# EAGLE design avr-hvsp-programmer (EAGLE 7.7.0)
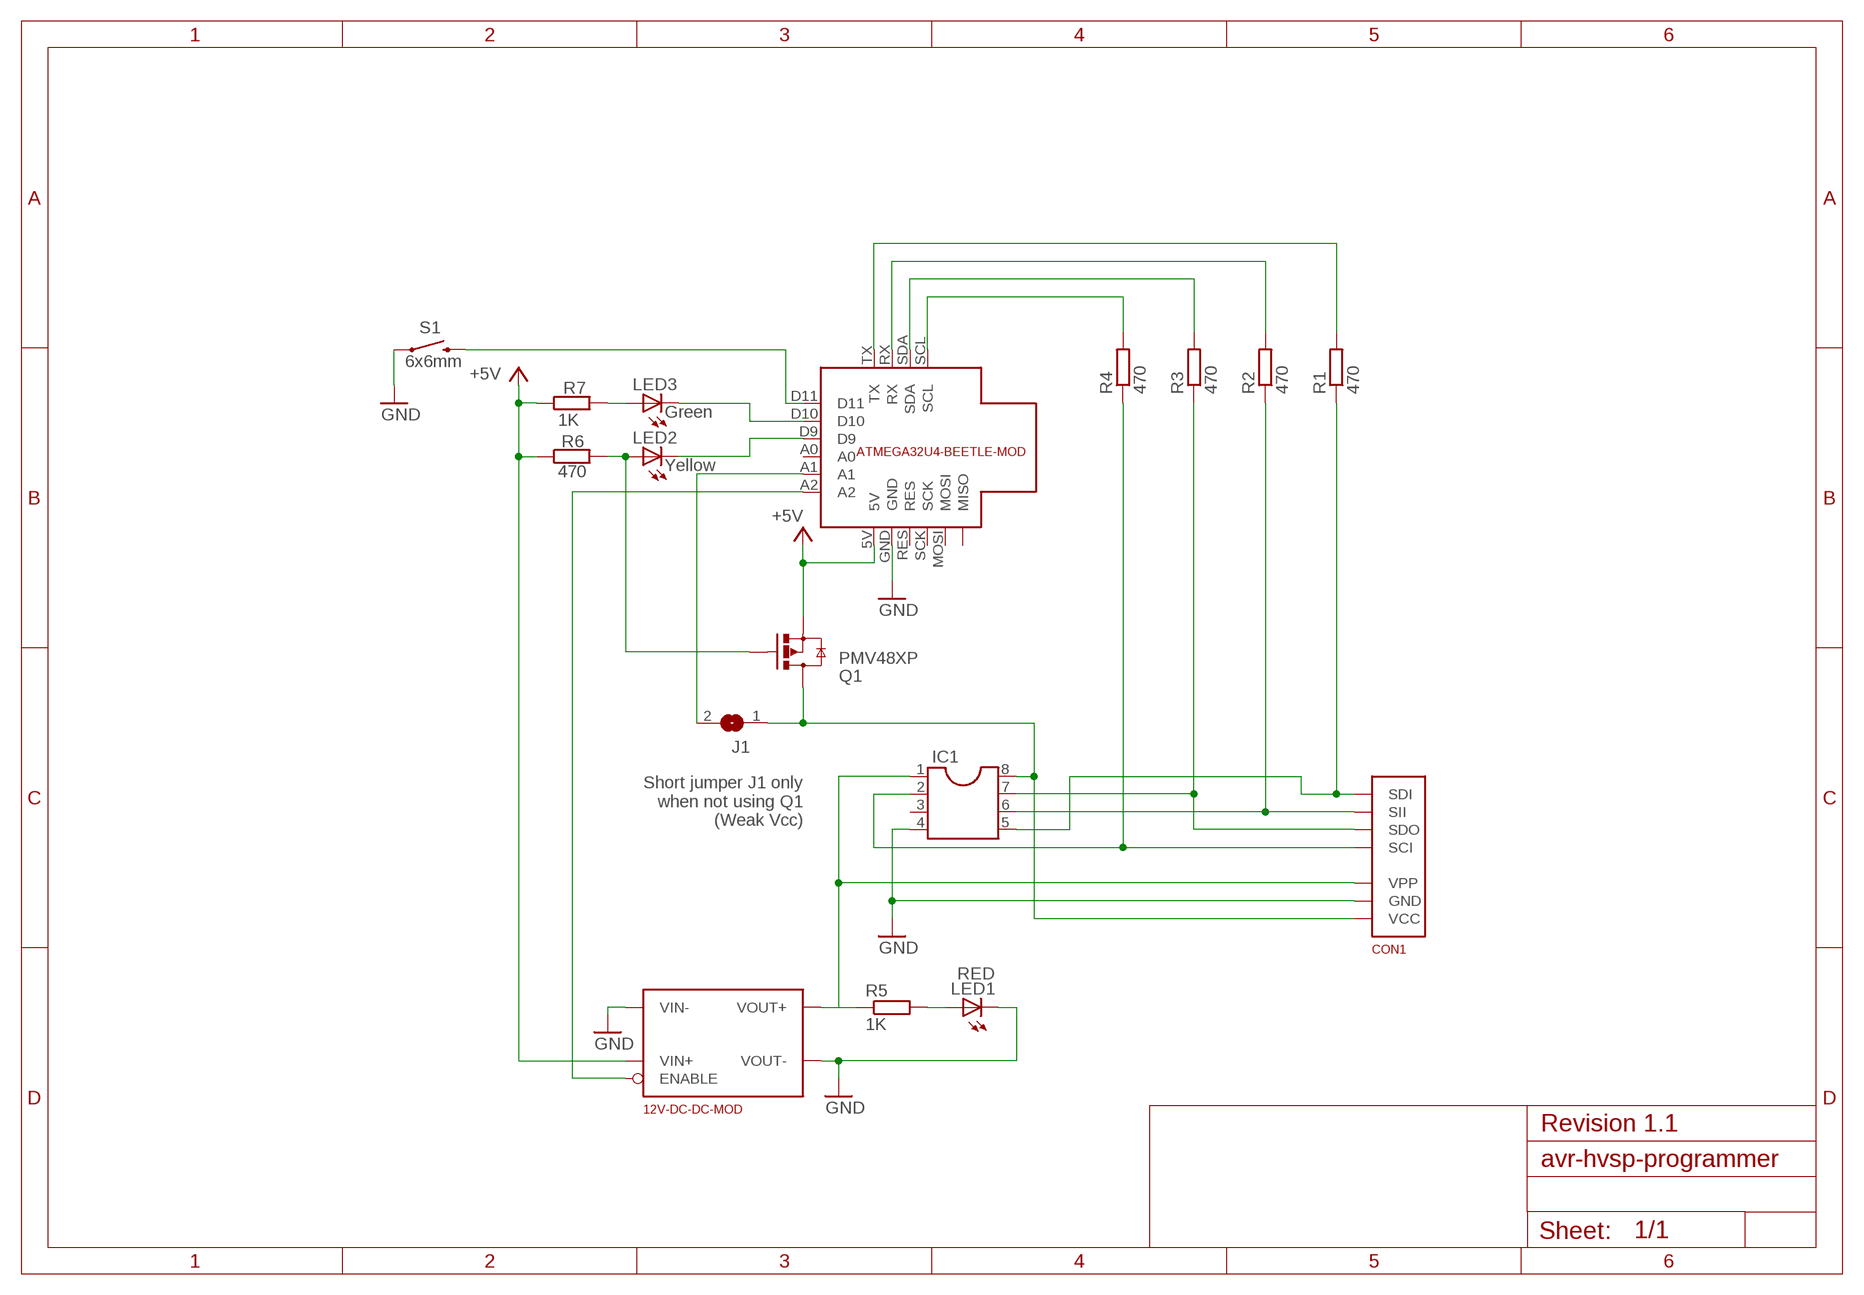
[diagram p0: schematic, sheet 1]

## Parts
12V-DC-DC-MOD  12V-DC-DC-CONVERTER-WITH_ENABLE  [12V-DC-DC-CONVERTER-WITH-ENABLE]
ATMEGA32U4-BEETLE-MOD  ATMEGA32U4-BEETLE-BOARD  [ATMEGA32U4-BEETLE-BOARD]
CON1  HVSP-HEADER  [HVSP-HEADER]
IC1  DIL8S  [SOCKET-08]
J1  SJ  [SJ]
LED1  RED  LED3MM  [LED3MM]
LED2  Yellow  LED3MM  [LED3MM]
LED3  Green  LED3MM  [LED3MM]
Q1  PMV48XP  NX3008PBK  [SOT23-3]
R1  470  R-EU_0207/7  [0207/7]
R2  470  R-EU_0207/7  [0207/7]
R3  470  R-EU_0207/7  [0207/7]
R4  470  R-EU_0207/7  [0207/7]
R5  1K  R-EU_0207/10  [0207/10]
R6  470  R-EU_0207/10  [0207/10]
R7  1K  R-EU_0207/10  [0207/10]
S1  6x6mm  MOMENTARY-SWITCH-SPST-PTH-6.0MM  [TACTILE_SWITCH_PTH_6.0MM]

## Nets
+5V: 12V-DC-DC-MOD.VIN+ ATMEGA32U4-BEETLE-MOD.5V Q1.2(S) R6.1 R7.1
GND: 12V-DC-DC-MOD.VIN- 12V-DC-DC-MOD.VOUT- ATMEGA32U4-BEETLE-MOD.GND CON1.GND IC1.4 LED1.K(C) S1.1
LED2: ATMEGA32U4-BEETLE-MOD.D9 LED2.K(C)
LED3: ATMEGA32U4-BEETLE-MOD.D10 LED3.K(C)
N$5: ATMEGA32U4-BEETLE-MOD.TX R1.2
N$6: ATMEGA32U4-BEETLE-MOD.RX R2.2
N$7: ATMEGA32U4-BEETLE-MOD.SDA R3.2
N$8: ATMEGA32U4-BEETLE-MOD.SCL R4.2
R-LED1: LED1.A R5.2
R-LED2: LED2.A Q1.1(G) R6.2
R-LED3: LED3.A R7.2
S1: ATMEGA32U4-BEETLE-MOD.D11 S1.3
SCI: CON1.SCI IC1.2 R4.1
SDI: CON1.SDI IC1.5 R1.1
SDO: CON1.SDO IC1.7 R3.1
SII: CON1.SII IC1.6 R2.1
VCC: CON1.VCC IC1.8 J1.1 Q1.3(D)
VCC_WEAK: ATMEGA32U4-BEETLE-MOD.A1 J1.2
VPP: 12V-DC-DC-MOD.VOUT+ CON1.VPP IC1.1 R5.1
VPP_ENABLE: 12V-DC-DC-MOD.ENABLE ATMEGA32U4-BEETLE-MOD.A2
Unconnected: ATMEGA32U4-BEETLE-MOD.A0 ATMEGA32U4-BEETLE-MOD.MISO ATMEGA32U4-BEETLE-MOD.MOSI ATMEGA32U4-BEETLE-MOD.RES ATMEGA32U4-BEETLE-MOD.SCK IC1.3

## Notes on the sheet
- Short jumper J1 only
   when not using Q1
       (Weak Vcc)
- Revision 1.1

## Library data of the parts
12V-DC-DC-MOD = modules:12V-DC-DC-CONVERTER-WITH_ENABLE
ATMEGA32U4-BEETLE-MOD = modules:ATMEGA32U4-BEETLE-BOARD
CON1 = modules:HVSP-HEADER
IC1 = ic-package:DIL8: Dual In Line / Socket
J1 = jumper:SJ: SMD solder JUMPER
LED1-LED3 = led:LED: LED OSRAM: - CHIPLED LG R971, LG N971, LY N971, LG Q971, LY Q971, LO R971, LY R971 LH N974, LH R974 LS Q976, LO Q976, LY Q976 LO Q996 - Hyper CHIPLED LW Q18S LB Q993, LB Q99A, LB R99A - SideLED LS A670, LO A670, LY A670, LG A670, LP A670 LB A673, LV A673, LT A673, LW A673 LH A674 LY A675 LS A676, LA A676, LO A676, LY A676, LW A676 LS A679, LY A679, LG A679 - Hyper Micro SIDELED® LS Y876, LA Y876, LO Y876, LY Y876 LT Y87S - SmartLED LW L88C, LW L88S LB L89C, LB L89S, LG L890 LS L89K, LO L89K, LY L89K LS L896, LA L896, LO L896, LY L896 - TOPLED LS T670, LO T670, LY T670, LG T670, LP T670 LSG T670, LSP T670, LSY T670, LOP T670, LYG T670 LG T671, LOG T671, LSG T671 LB T673, LV T673, LT T673, LW T673 LH T674 LS T676, LA T676, LO T676, LY T676, LB T676, LH T676, LSB T676, LW T676 LB T67C, LV T67C, LT T67C, LS T67K, LO T67K, LY T67K, LW E67C LS E67B, LA E67B, LO E67B, LY E67B, LB E67C, LV E67C, LT E67C LW T67C LS T679, LY T679, LG T679 LS T770, LO T770, LY T770, LG T770, LP T770 LB T773, LV T773, LT T773, LW T773 LH T774 LS E675, LA E675, LY E675, LS T675 LS T776, LA T776, LO T776, LY T776, LB T776 LHGB T686 LT T68C, LB T68C - Hyper Mini TOPLED® LB M676 - Mini TOPLED Santana® LG M470 LS M47K, LO M47K, LY M47K Source: http://www.osram.convergy.de LUXEON: - LUMILED® LXK2-PW12-R00, LXK2-PW12-S00, LXK2-PW14-U00, LXK2-PW14-V00 LXK2-PM12-R00, LXK2-PM12-S00, LXK2-PM14-U00 LXK2-PE12-Q00, LXK2-PE12-R00, LXK2-PE12-S00, LXK2-PE14-T00, LXK2-PE14-U00 LXK2-PB12-K00, LXK2-PB12-L00, LXK2-PB12-M00, LXK2-PB14-N00, LXK2-PB14-P00, LXK2-PB14-Q00 LXK2-PR12-L00, LXK2-PR12-M00, LXK2-PR14-Q00, LXK2-PR14-R00 LXK2-PD12-Q00, LXK2-PD12-R00, LXK2-PD12-S00 LXK2-PH12-R00, LXK2-PH12-S00 LXK2-PL12-P00, LXK2-PL12-Q00, LXK2-PL12-R00 Source: www.luxeon.com KINGBRIGHT: KA-3528ASYC Source: www.kingbright.com
Q1 = fets:NX3008PBK: MOSFET - P Channel; DIGIKEY: 568-10499-1-ND; MANUFACTURER: Nexperia; MOUSER: 771-NX3008PBK,215; MPN: NX3008PBK,215; NEWARK: 74T4665
R1-R7 = rcl:R-EU_: RESISTOR, European symbol
S1 = SparkFun-Switches:MOMENTARY-SWITCH-SPST: Momentary Switch (Pushbutton) - SPST Normally-open (NO) SPST momentary switches (buttons, pushbuttons). Variants PTH-12MM - 12mm square, through-hole Momentary Pushbutton Switch - 12mm Square <https://www.sparkfun.com/products/9190> (COM-09190) PTH-6.0MM, PTH-6.0MM-KIT - 6.0mm square, through-hole Mini Pushbutton Switch <https://www.sparkfun.com/products/97> (COM-00097) KIT package intended for soldering kit's - only one side of pads' copper is exposed. PTH-RIGHT-ANGLE-KIT - Right-angle, through-hole Right Angle Tactile Button <https://www.sparkfun.com/products/10791> - Used on SparkFun BigTime Watch Kit <https://www.sparkfun.com/products/11734> SMD-12MM - 12mm square, surface-mount Tactile Button - SMD (12mm) <https://www.sparkfun.com/products/12993> (COM-12993) Used on SparkFun PicoBoard <https://www.sparkfun.com/products/11888> SMD-4.5MM - 4.5mm Square Trackball Switch Used on SparkFun Blackberry Trackballer Breakout <https://www.sparkfun.com/products/13169> SMD-4.6MMX2.8MM - 4.60mm x 2.80mm, surface mount Used on SparkFun SAMD21 Mini Breakout <https://www.sparkfun.com/products/13664> SMD-5.2MM, SMD-5.2-REDUNDANT - 5.2mm square, surface-mount Mini Pushbutton Switch - SMD <https://www.sparkfun.com/products/8720> (COM-08720) Used on Arduino Pro Mini <https://www.sparkfun.com/products/11114> REDUNDANT package connects both switch circuits together SMD-6.0X3.5MM - 6.0 x 3.5mm, surface mount Momentary Reset Switch SMD <https://www.sparkfun.com/products/8229> (COM-08229) SMD-6.2MM-TALL - 6.2mm square, surface mount Tactile Button - SMD (6mm) <https://www.sparkfun.com/products/12992> Used on SparkFun Digital Sandbox <https://www.sparkfun.com/products/12651> SMD-RIGHT-ANGLE - Right-angle, surface mount Used on SparkFun Block for Intel® Edison - Arduino <https://www.sparkfun.com/products/13036>; PROD_ID: SWCH-08441; SF_SKU: COM-00097

## Board
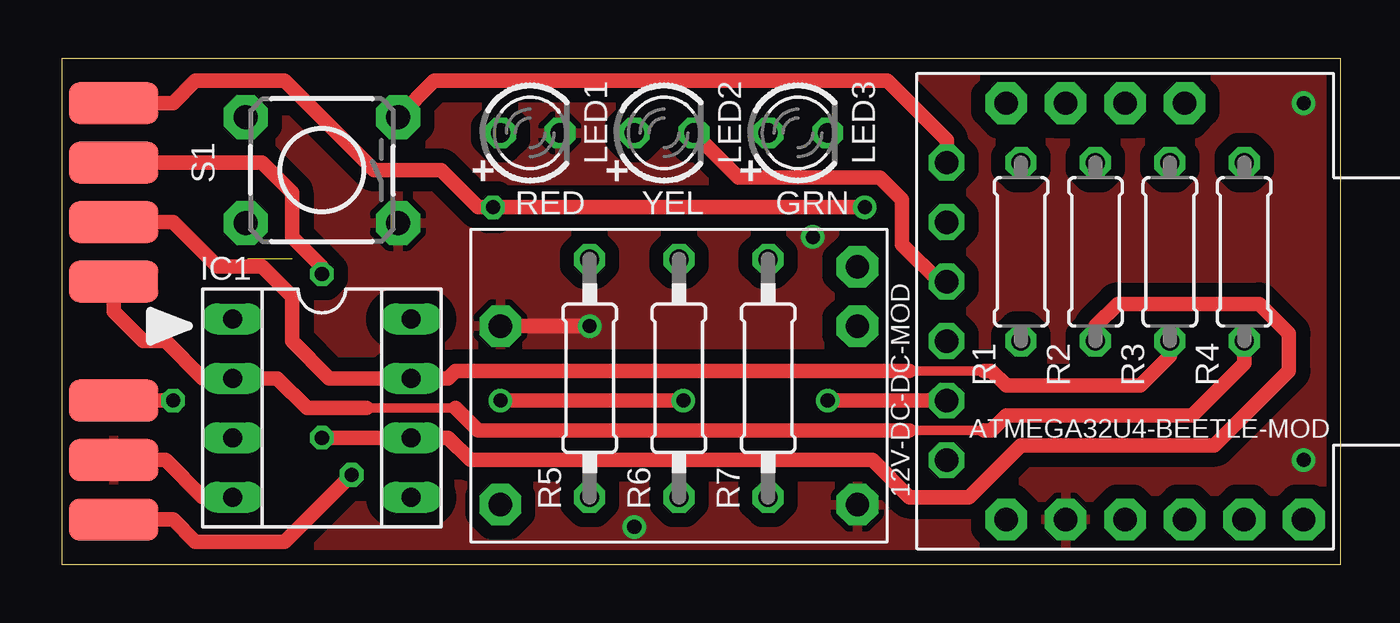
[diagram p1: board, top side]
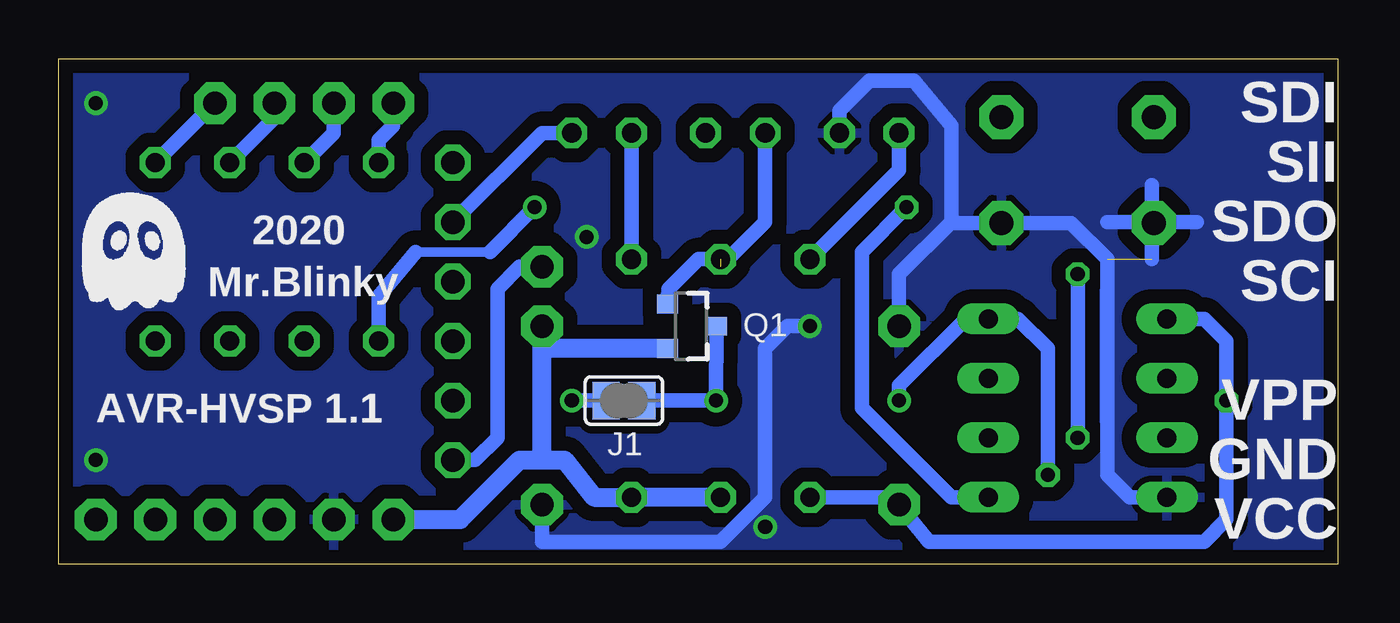
[diagram p2: board, bottom side, seen from below]

Size 54.61 x 21.59 mm. Coordinates in mm from the lower left corner, seen from the top.
Outline: 0,0 54.61,0 54.61,21.59 0,21.58 0,0
Copper layers (1*16): Top 0.035mm / dielectric 1.5mm / Bottom 0.035mm
Design rules "default *": minimum track width 10mil, minimum drill 24mil, track to track 8mil, track to pad 8mil, pad to pad 8mil, via to via 8mil, smd to smd 8mil, copper to edge 20mil, drill to drill 8mil, minimum pad ring 10mil, minimum via ring 8mil, stop-mask expansion 4mil, vias tented up to drill 0mil, thermal gap 10mil
tRestrict: area 3.5,1.6 to 9.2,5.7

### Footprints (pad centres in the part's own frame; a part is rotated, then mirrored left to right if it is on the bottom)
12V-DC-DC-CONVERTER-WITH-ENABLE = drill 1 pad 1.778 octagon: ENABLE 3.81,-7.62; VIN+ 1.27,-7.62; VIN- -6.35,-7.62; VOUT+ -6.35,7.62; VOUT- 1.27,7.62
ATMEGA32U4-BEETLE-BOARD = drill 1 pad 1.778 octagon: 5V -7.62,-8.89; GND -5.08,-8.89; MISO 5.08,-8.89; MOSI 2.54,-8.89; RES -2.54,-8.89; RX -5.08,8.89; SCK 0,-8.89; SCL 0,8.89; SDA -2.54,8.89; TX -7.62,8.89 | drill 1 pad 1.524 octagon: A0 -10.16,-1.27; A1 -10.16,-3.81; A2 -10.16,-6.35; D9 -10.16,1.27; D10 -10.16,3.81; D11 -10.16,6.35
HVSP-HEADER = smd 3.81 x 1.778: GND 0,-6.35; SCI 0,1.27; SDI 0,8.89; SDO 0,3.81; SII 0,6.35; VCC 0,-8.89; VPP 0,-3.81
SOCKET-08 = drill 0.813 long: 1 -3.81,-3.81; 2 -1.27,-3.81; 3 1.27,-3.81; 4 3.81,-3.81; 5 3.81,3.81; 6 1.27,3.81; 7 -1.27,3.81; 8 -3.81,3.81
SJ = smd 1.168 x 1.6: 1 -0.762,0; 2 0.762,0
LED3MM = drill 0.813 octagon: A -1.27,0; K 1.27,0
SOT23-3 = smd 0.8 x 0.9: 1 -0.95,-1; 2 0.95,-1; 3 0,1.1
0207/7 = drill 0.813 octagon: 1 -3.81,0; 2 3.81,0
0207/10 = drill 0.813 octagon: 1 -5.08,0; 2 5.08,0
TACTILE_SWITCH_PTH_6.0MM = drill 1.016 pad 1.88 octagon: 1 -3.251,2.261; 2 3.251,2.261; 3 -3.251,-2.261; 4 3.251,-2.261

### Placement (x,y rotation side)
12V-DC-DC-MOD  26.35,8.89 90 top
ATMEGA32U4-BEETLE-MOD  47.94,10.79 0 top
CON1  2.22,10.79 0 top
IC1  11.11,6.67 270 top
J1  30.48,6.98 180 bottom
LED1  20,18.42 0 top
LED2  25.72,18.42 0 top
LED3  31.43,18.42 0 top
Q1  27.62,10.16 270 bottom
R1  40.96,13.33 90 top
R2  44.13,13.33 90 top
R3  47.31,13.33 90 top
R4  50.48,13.33 90 top
R5  22.54,7.94 90 top
R6  26.35,7.94 90 top
R7  30.16,7.94 90 top
S1  11.11,16.83 180 top

### Tracks (layer width: path | path; a pad name or v marks a point on that pad's centre or on a via)
+5V
  Bottom 0.813: 33.97,4.45 33.02,4.45 31.75,2.86 R7.1 R6.1 | ATMEGA32U4-BEETLE-MOD.5V 37.46,1.91 34.93,4.45 33.97,4.45 | 33.97,4.45 33.97,9.21 | 33.97,9.21 12V-DC-DC-MOD.VIN+ | Q1.2 33.97,9.21
GND  (via drill 0.6)  (1 unrouted)
  Top 0.61: CON1.GND 4.45,4.45 6.03,2.86 IC1.4 | 34.13,2.38 12V-DC-DC-MOD.VIN- 34.13,2.7 | 12V-DC-DC-MOD.VOUT- v22.54,10.16
  Bottom 0.61: 12V-DC-DC-MOD.VOUT- 18.73,12.38 16.51,14.61 | 16.51,14.61 16.51,18.73 18.1,20.64 20,20.64 21.27,19.37 LED1.K | 16.51,14.61 16.47,14.57 S1.1 11.39,14.57 9.84,13.02 9.84,3.81 8.89,2.86 IC1.4 | 12V-DC-DC-MOD.VIN- 33.97,0.95 26.35,0.95 24.45,2.86 24.45,9.21 23.49,10.16 v22.54,10.16 | 6.03,14.61 9.84,14.61 | 7.94,16.19 7.94,13.02
  other vias: 53.02,4.45 53.02,19.69 24.45,1.59 32.07,13.97
  pour Bottom (isolate 0.61): -0.32,22.23 55.56,22.23 55.56,-0.64 -0.32,-0.64
  pour Top (isolate 0.61): -0.32,22.23 55.56,22.23 55.56,-0.64 -0.32,-0.64
LED2
  Top 0.61: ATMEGA32U4-BEETLE-MOD.D9 37.46,12.06 35.88,13.65 35.88,15.56 34.93,16.51 28.89,16.51 LED2.K
LED3
  Bottom 0.61: LED3.K 33.97,18.42 ATMEGA32U4-BEETLE-MOD.D10
N$5
  Bottom 0.61: ATMEGA32U4-BEETLE-MOD.TX 40.32,18.73 40.96,18.1 R1.2
N$6
  Bottom 0.61: ATMEGA32U4-BEETLE-MOD.RX 42.86,18.42 R2.2
N$7
  Bottom 0.61: ATMEGA32U4-BEETLE-MOD.SDA 45.4,19.05 R3.2
N$8
  Bottom 0.61: ATMEGA32U4-BEETLE-MOD.SCL R4.2
R-LED1
  Bottom 0.61: LED1.A 18.73,16.83 R5.2
R-LED2  (1 unrouted)
  Bottom 0.61: LED2.A 24.45,14.61 26.35,12.7 | R6.2 27.31,13.02 28.57,11.75 Q1.1
R-LED3
  Bottom 0.61: LED3.A R7.2
S1
  Top 0.61: S1.3 15.91,20.64 35.24,20.64 37.78,18.1 ATMEGA32U4-BEETLE-MOD.D11
SCI
  Top 0.406: 39.37,5.71 36.2,5.71 | 16.83,6.67 13.02,6.67
  Top 0.61: CON1.SCI 2.22,10.79 3.49,9.53 4.45,9.53 6.03,7.94 IC1.2 9.21,7.94 10.48,6.67 13.02,6.67 | R4.1 50.48,8.57 48.26,6.35 40.32,6.35 39.69,5.71 39.37,5.71 | 36.2,5.71 17.78,5.71 16.83,6.67
SDI  (via drill 0.6)
  Top 0.61: CON1.SDI 4.76,19.69 5.71,20.64 9.52,20.64 13.34,16.83 16.19,16.83 17.78,15.24 v18.42,15.24 v34.29,15.24
  Bottom 0.406: 39.37,13.33 36.2,13.33
  Bottom 0.61: IC1.5 16.51,2.86 20.32,6.67 20.32,13.33 v18.42,15.24 | R1.1 40.96,11.43 39.37,13.33 | v34.29,15.24 36.2,13.33
SDO
  Top 0.406: 39.37,8.26 36.2,8.26
  Top 0.61: CON1.SDO 4.76,14.61 6.67,12.7 8.57,12.7 9.84,11.43 9.84,9.53 11.43,7.94 IC1.7 16.51,7.94 16.83,8.26 36.2,8.26 | R3.1 47.31,8.89 46.04,7.62 40.32,7.62 39.69,8.26 39.37,8.26
SII  (via drill 0.6)
  Top 0.61: CON1.SII 8.57,17.15 9.84,15.88 9.84,13.97 11.11,12.7 v11.11,12.38 | v11.11,5.4 IC1.6 16.51,5.4 17.46,4.45 34.61,4.45 36.2,2.86 38.73,2.86 40.96,5.08 49.21,5.08 52.39,8.26 52.39,9.84 51.12,11.11 45.09,11.11 44.13,10.16 R2.1
  Bottom 0.61: v11.11,5.4 v11.11,12.38
VCC  (via drill 0.6)
  Top 0.61: CON1.VCC 4.76,1.91 5.71,0.95 9.52,0.95 v12.38,3.81 | v26.54,6.98 v18.73,6.98
  Bottom 0.61: v12.38,3.81 12.38,9.21 13.65,10.48 IC1.8 15.88,10.48 18.73,7.62 v18.73,6.98 | J1.1 v26.54,6.98 Q1.3
VCC_WEAK  (via drill 0.6)
  Top 0.61: ATMEGA32U4-BEETLE-MOD.A1 v32.7,6.98
  Bottom 0.61: J1.2 v32.7,6.98
VPP  (via drill 0.6)
  Top 0.61: 2.22,7.3 CON1.VPP v4.76,6.98
  Bottom 0.61: IC1.1 5.71,10.48 4.76,9.53 v4.76,6.98 4.76,1.91 5.71,0.95 17.46,0.95 12V-DC-DC-MOD.VOUT+ 18.73,2.86 R5.1
VPP_ENABLE
  Bottom 0.61: ATMEGA32U4-BEETLE-MOD.A2 36.83,4.45 35.88,5.4 35.88,11.75 34.93,12.7 12V-DC-DC-MOD.ENABLE

### Text on the board
tPlace: + | + | +
bPlace: SDI | SII | SDO | 2020 | SCI | Mr.Blinky | VPP | GND | AVR-HVSP 1.1 | VCC
tNames: RED | YEL | GRN